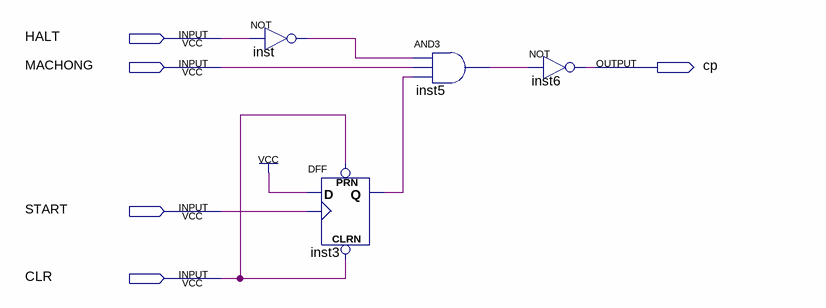
[diagram p0: schematic sheet]
// Quartus schematic start.bdf as structural Verilog: 4 symbols, 5 pins
module start (
  input  HALT,
  input  MACHONG,
  input  START,
  input  CLR,
  output cp
);

  wire inst3_q, inst5_out, inst_out;

  not inst (inst_out, HALT);
  DFF inst3 (.CLRN(CLR), .CLK(START), .D(1'b1), .PRN(CLR), .Q(inst3_q));
  and inst5 (inst5_out, inst_out, MACHONG, inst3_q);
  not inst6 (cp, inst5_out);
endmodule
